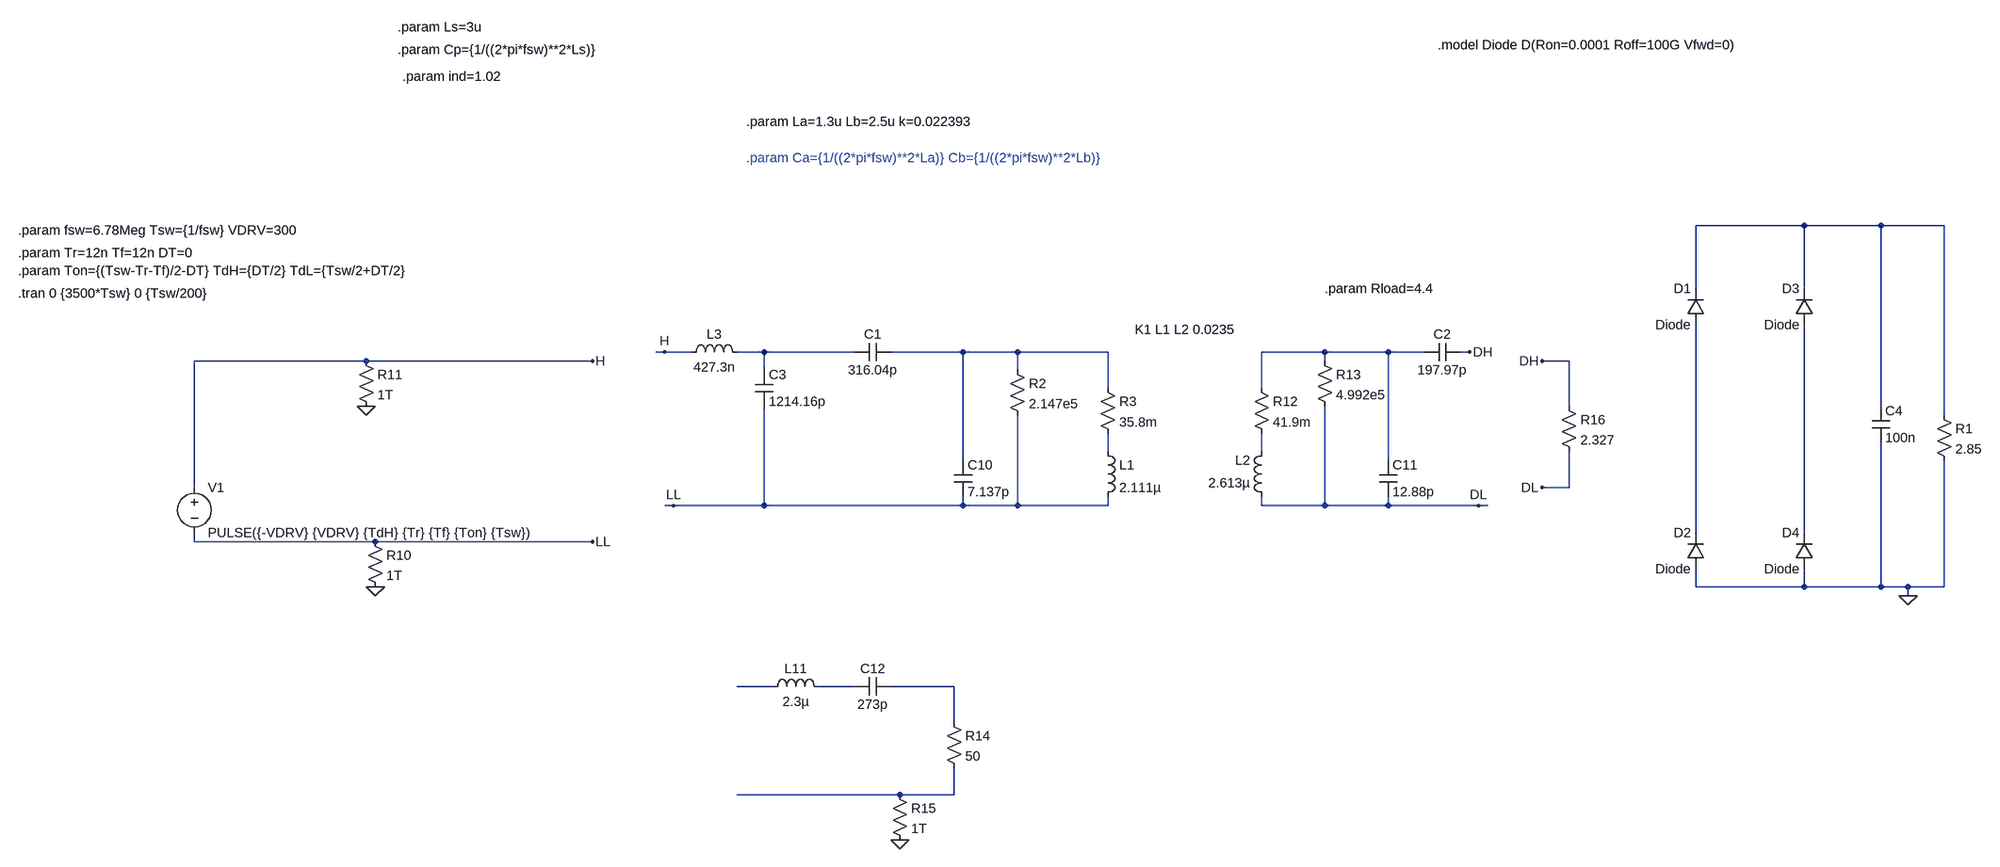
[diagram p0: schematic s-s-500W.asc]
s-s-500W.asc, the LTspice schematic file:
Version 4.1
SHEET 1 3228 1140
WIRE 2896 -160 2704 -160
WIRE 3040 -160 2896 -160
WIRE 3152 -160 3040 -160
WIRE 2704 -48 2704 -160
WIRE 2896 -48 2896 -160
WIRE 880 64 864 64
WIRE 928 64 880 64
WIRE 1056 64 1008 64
WIRE 1216 64 1056 64
WIRE 1408 64 1280 64
WIRE 1504 64 1408 64
WIRE 1664 64 1504 64
WIRE 2048 64 1936 64
WIRE 2160 64 2048 64
WIRE 2224 64 2160 64
WIRE 2304 64 2288 64
WIRE 352 80 48 80
WIRE 752 80 352 80
WIRE 2048 80 2048 64
WIRE 2480 80 2432 80
WIRE 1056 96 1056 64
WIRE 1504 96 1504 64
WIRE 1664 128 1664 64
WIRE 1936 128 1936 64
WIRE 2480 160 2480 80
WIRE 3040 160 3040 -160
WIRE 3152 176 3152 -160
WIRE 1664 240 1664 208
WIRE 1936 240 1936 208
WIRE 1408 256 1408 64
WIRE 2160 256 2160 64
WIRE 48 304 48 80
WIRE 2480 304 2480 240
WIRE 2480 304 2432 304
WIRE 896 336 880 336
WIRE 1056 336 1056 160
WIRE 1056 336 896 336
WIRE 1408 336 1408 320
WIRE 1408 336 1056 336
WIRE 1504 336 1504 176
WIRE 1504 336 1408 336
WIRE 1664 336 1664 320
WIRE 1664 336 1504 336
WIRE 1936 336 1936 320
WIRE 2048 336 2048 160
WIRE 2048 336 1936 336
WIRE 2160 336 2160 320
WIRE 2160 336 2048 336
WIRE 2320 336 2160 336
WIRE 2336 336 2320 336
WIRE 2704 384 2704 16
WIRE 2896 384 2896 16
WIRE 48 400 48 384
WIRE 368 400 48 400
WIRE 752 400 368 400
WIRE 2704 480 2704 448
WIRE 2896 480 2896 448
WIRE 2896 480 2704 480
WIRE 3040 480 3040 224
WIRE 3040 480 2896 480
WIRE 3088 480 3040 480
WIRE 3152 480 3152 256
WIRE 3152 480 3088 480
WIRE 3088 496 3088 480
WIRE 1072 848 1008 848
WIRE 1216 848 1152 848
WIRE 1392 848 1280 848
WIRE 1392 912 1392 848
WIRE 1296 1040 1008 1040
WIRE 1392 1040 1392 992
WIRE 1392 1040 1296 1040
FLAG 752 80 H
FLAG 752 400 LL
FLAG 2432 80 DH
FLAG 2432 304 DL
FLAG 2304 64 DH
FLAG 2320 336 DL
FLAG 896 336 LL
FLAG 3088 496 0
FLAG 880 64 H
FLAG 352 160 0
FLAG 368 480 0
FLAG 1296 1120 0
SYMBOL voltage 48 288 R0
WINDOW 123 0 0 Left 0
WINDOW 39 0 0 Left 0
SYMATTR InstName V1
SYMATTR Value PULSE({-VDRV} {VDRV} {TdH} {Tr} {Tf} {Ton} {Tsw})
SYMBOL cap 1216 80 R270
WINDOW 0 32 32 VTop 2
WINDOW 3 0 32 VBottom 2
SYMATTR InstName C1
SYMATTR Value 316.04p
SYMBOL cap 2288 48 R90
WINDOW 0 0 32 VBottom 2
WINDOW 3 32 32 VTop 2
SYMATTR InstName C2
SYMATTR Value 197.97p
SYMBOL res 3136 160 R0
SYMATTR InstName R1
SYMATTR Value 2.85
SYMBOL diode 2720 16 R180
WINDOW 0 24 64 Left 2
WINDOW 3 24 0 Left 2
SYMATTR InstName D1
SYMATTR Value Diode
SYMBOL cap 3024 160 R0
SYMATTR InstName C4
SYMATTR Value 100n
SYMBOL diode 2720 448 R180
WINDOW 0 24 64 Left 2
WINDOW 3 24 0 Left 2
SYMATTR InstName D2
SYMATTR Value Diode
SYMBOL diode 2912 16 R180
WINDOW 0 24 64 Left 2
WINDOW 3 24 0 Left 2
SYMATTR InstName D3
SYMATTR Value Diode
SYMBOL diode 2912 448 R180
WINDOW 0 24 64 Left 2
WINDOW 3 24 0 Left 2
SYMATTR InstName D4
SYMATTR Value Diode
SYMBOL res 352 384 R0
SYMATTR InstName R10
SYMATTR Value 1T
SYMBOL res 336 64 R0
SYMATTR InstName R11
SYMATTR Value 1T
SYMBOL cap 1392 256 R0
SYMATTR InstName C10
SYMATTR Value 7.137p
SYMBOL ind 1648 224 R0
SYMATTR InstName L1
SYMATTR Value 2.111µ
SYMATTR Type ind
SYMATTR SpiceLine Rser=1m
SYMBOL ind 1952 336 R180
WINDOW 0 36 80 Left 2
WINDOW 3 36 40 Left 2
SYMATTR InstName L2
SYMATTR Value 2.613µ
SYMATTR Type ind
SYMATTR SpiceLine Rser=1m
SYMBOL res 1648 112 R0
SYMATTR InstName R3
SYMATTR Value 35.8m
SYMBOL res 1920 112 R0
SYMATTR InstName R12
SYMATTR Value 41.9m
SYMBOL cap 2144 256 R0
SYMATTR InstName C11
SYMATTR Value 12.88p
SYMBOL cap 1280 832 R90
WINDOW 0 0 32 VBottom 2
WINDOW 3 32 32 VTop 2
SYMATTR InstName C12
SYMATTR Value 273p
SYMBOL res 1376 896 R0
SYMATTR InstName R14
SYMATTR Value 50
SYMBOL ind 1056 864 R270
WINDOW 0 32 56 VTop 2
WINDOW 3 5 56 VBottom 2
SYMATTR InstName L11
SYMATTR Value 2.3µ
SYMATTR SpiceLine Rser=1m
SYMBOL res 1280 1024 R0
SYMATTR InstName R15
SYMATTR Value 1T
SYMBOL res 2464 144 R0
SYMATTR InstName R16
SYMATTR Value 2.327
SYMBOL ind 912 80 R270
WINDOW 0 32 56 VTop 2
WINDOW 3 5 56 VBottom 2
SYMATTR InstName L3
SYMATTR Value 427.3n
SYMATTR SpiceLine Rser=1m
SYMBOL cap 1040 96 R0
SYMATTR InstName C3
SYMATTR Value 1214.16p
SYMBOL res 1488 80 R0
SYMATTR InstName R2
SYMATTR Value 2.147e5
SYMBOL res 2032 64 R0
SYMATTR InstName R13
SYMATTR Value 4.992e5
TEXT -264 -152 Left 2 !.param fsw=6.78Meg Tsw={1/fsw} VDRV=300
TEXT -264 -40 Left 2 !.tran 0 {3500*Tsw} 0 {Tsw/200}
TEXT 1024 -344 Left 2 !.param La=1.3u Lb=2.5u k=0.022393
TEXT 1024 -280 Left 2 ;.param Ca={1/((2*pi*fsw)**2*La)} Cb={1/((2*pi*fsw)**2*Lb)}
TEXT 1712 24 Left 2 !K1 L1 L2 0.0235
TEXT 408 -472 Left 2 !.param Cp={1/((2*pi*fsw)**2*Ls)}
TEXT 408 -512 Left 2 !.param Ls=3u
TEXT 416 -424 Left 2 !.param ind=1.02
TEXT 2248 -480 Left 2 !.model Diode D(Ron=0.0001 Roff=100G Vfwd=0)
TEXT 2048 -48 Left 2 !.param Rload=4.4
TEXT -264 -112 Left 2 !.param Tr=12n Tf=12n DT=0
TEXT -264 -80 Left 2 !.param Ton={(Tsw-Tr-Tf)/2-DT} TdH={DT/2} TdL={Tsw/2+DT/2}

The netlist it stands for:
* s-s-500W.asc
V1 H LL PULSE({-VDRV} {VDRV} {TdH} {Tr} {Tf} {Ton} {Tsw})
C1 N002 N003 316.04p
C2 DH N004 197.97p
R1 N001 0 2.85
D1 N007 N001 Diode
C4 N001 0 100n
D2 0 N007 Diode
D3 N008 N001 Diode
D4 0 N008 Diode
R10 LL 0 1T
R11 H 0 1T
C10 N003 LL 7.137p
L1 N005 LL 2.111µ Rser=1m
L2 DL N006 2.613µ Rser=1m
R3 N003 N005 35.8m
R12 N004 N006 41.9m
C11 N004 DL 12.88p
C12 N011 N010 273p
R14 N011 N012 50
L11 N009 N010 2.3µ Rser=1m
R15 N012 0 1T
R16 DH DL 2.327
L3 H N002 427.3n Rser=1m
C3 N002 LL 1214.16p
R2 N003 LL 2.147e5
R13 N004 DL 4.992e5
.model D D
.lib standard.dio
.param fsw=6.78Meg Tsw={1/fsw} VDRV=300
.tran 0 {3500*Tsw} 0 {Tsw/200}
.param La=1.3u Lb=2.5u k=0.022393
* .param Ca={1/((2*pi*fsw)**2*La)} Cb={1/((2*pi*fsw)**2*Lb)}
K1 L1 L2 0.0235
.param Cp={1/((2*pi*fsw)**2*Ls)}
.param Ls=3u
.param ind=1.02
.model Diode D(Ron=0.0001 Roff=100G Vfwd=0)
.param Rload=4.4
.param Tr=12n Tf=12n DT=0
.param Ton={(Tsw-Tr-Tf)/2-DT} TdH={DT/2} TdL={Tsw/2+DT/2}
.backanno
.end